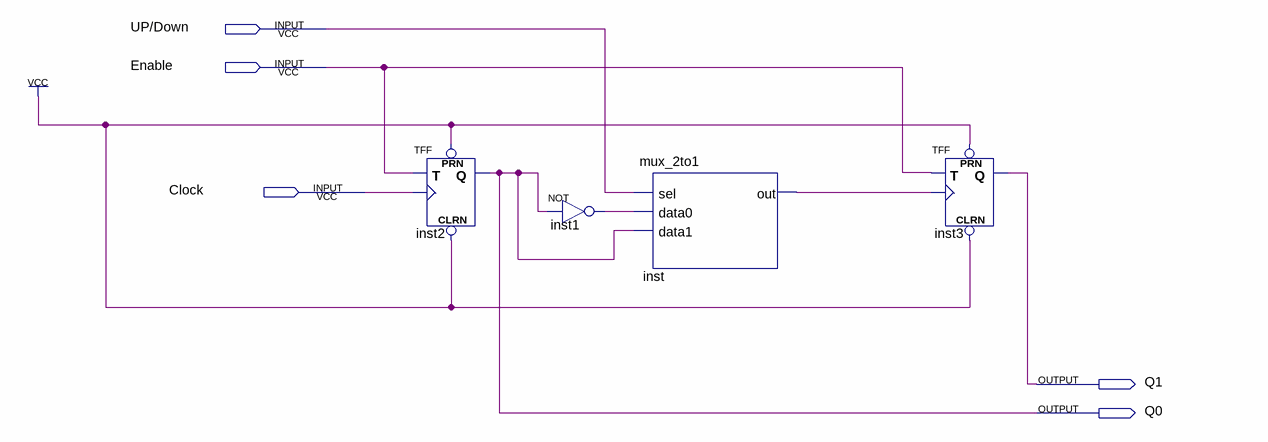
[diagram p0: schematic sheet]
// Quartus schematic UpDownCounter.bdf as structural Verilog: 4 symbols, 5 pins
module UpDownCounter (
  input  \UP/Down ,
  input  Enable,
  input  Clock,
  output Q1,
  output Q0
);

  wire inst1_out, inst_out;

  TFF inst2 (.PRN(1'b1), .CLRN(1'b1), .T(Enable), .CLK(Clock), .Q(Q0));
  not inst1 (inst1_out, Q0);
  mux_2to1 inst (.sel(\UP/Down ), .data0(inst1_out), .data1(Q0), .out(inst_out));
  TFF inst3 (.PRN(1'b1), .CLRN(1'b1), .T(Enable), .CLK(inst_out), .Q(Q1));
endmodule
